# Altium schematic sheet Sub_B_PCB.SchDoc
size C; SheetNumber: 1; SheetTotal: 1
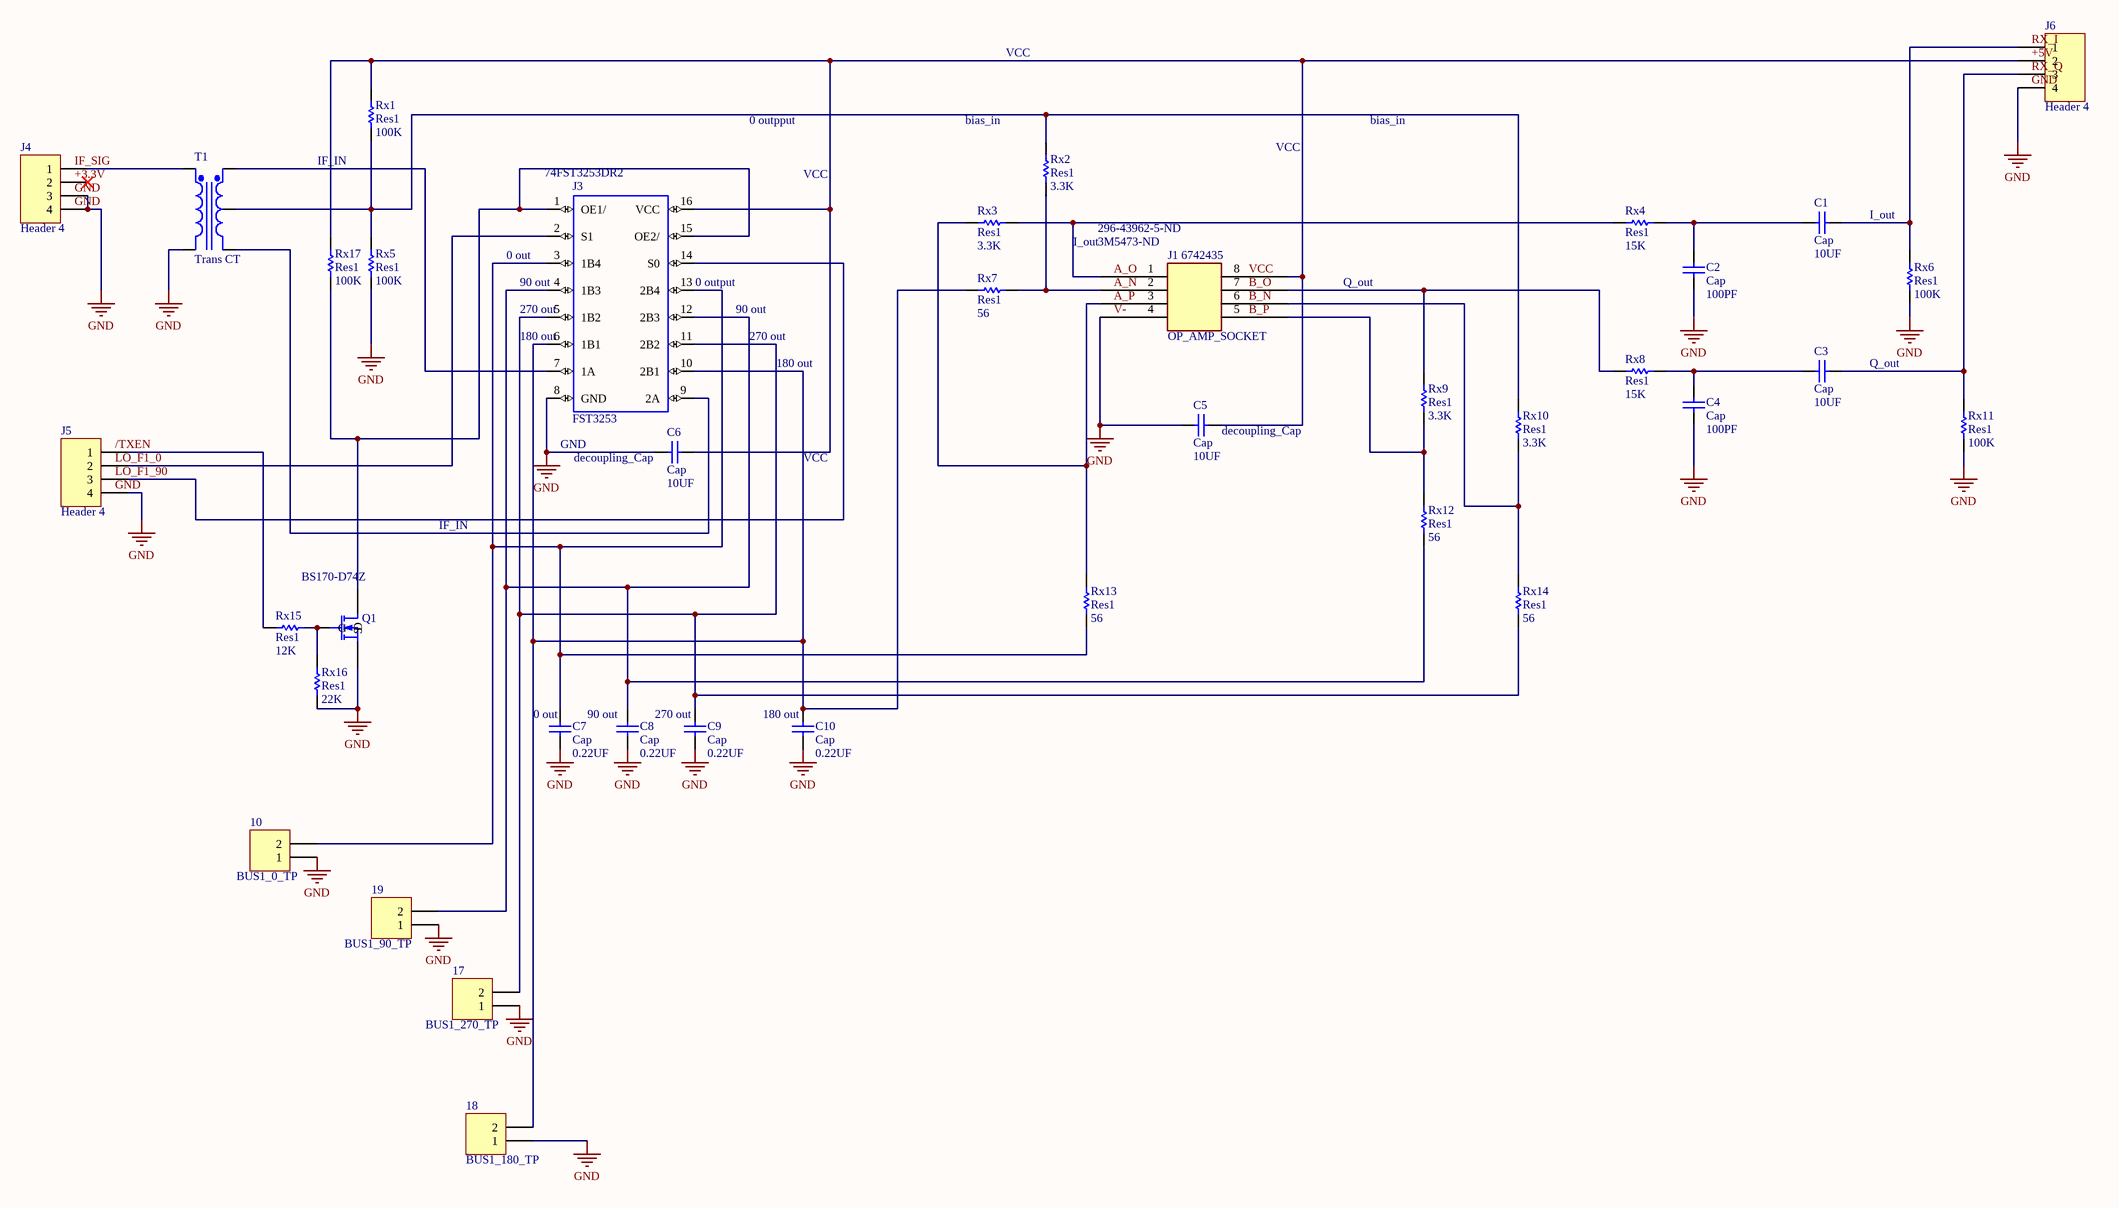
[diagram p0: Sub_B_PCB.SchDoc]

## Parts
10  BUS1_0_TP  [HDR1X2]
17  BUS1_270_TP  [HDR1X2]
18  BUS1_180_TP  [HDR1X2]
19  BUS1_90_TP  [HDR1X2]
C1  Cap  value 10UF  [1206]
C2  Cap  value 100PF  [RADIAL-0.1]
C3  Cap  value 10UF  [1206]
C4  Cap  value 100PF  [RADIAL-0.1]
C5  Cap  value 10UF  [1206]
C6  Cap  value 10UF  [1206]
C7  Cap  value 0.22UF  [RADIAL-0.1]
C8  Cap  value 0.22UF  [RADIAL-0.1]
C9  Cap  value 0.22UF  [RADIAL-0.1]
C10  Cap  value 0.22UF  [RADIAL-0.1]
J1  OP_AMP_SOCKET  Supplier Part Number 2: 6742435  Supplier Part Number 3: 3M5473-ND  Supplier Part Number 4: 296-43962-5-ND  [TE_1-2199298-2]
J3  FST3253  Supplier Part Number 1: 74FST3253DR2  [SOIC127P600X175-16N]
J4  Header 4  [HDR1X4]
J5  Header 4  [HDR1X4]
J6  Header 4  [HDR1X4]
Q1  Supplier Part Number 1: BS170-D74Z  [E3]  (hidden comment: MOSFET-N)
Rx1  Res1  value 100K  [AXIAL-0.1-RES]
Rx2  Res1  value 3.3K  [AXIAL-0.1-RES]
Rx3  Res1  value 3.3K  [AXIAL-0.1-RES]
Rx4  Res1  value 15K  [AXIAL-0.1-RES]
Rx5  Res1  value 100K  [AXIAL-0.1-RES]
Rx6  Res1  value 100K  [AXIAL-0.1-RES]
Rx7  Res1  value 56  [AXIAL-0.1-RES]
Rx8  Res1  value 15K  [AXIAL-0.1-RES]
Rx9  Res1  value 3.3K  [AXIAL-0.1-RES]
Rx10  Res1  value 3.3K  [AXIAL-0.1-RES]
Rx11  Res1  value 100K  [AXIAL-0.1-RES]
Rx12  Res1  value 56  [AXIAL-0.1-RES]
Rx13  Res1  value 56  [AXIAL-0.1-RES]
Rx14  Res1  value 56  [AXIAL-0.1-RES]
Rx15  Res1  value 12K  [AXIAL-0.1-RES]
Rx16  Res1  value 22K  [AXIAL-0.1-RES]
Rx17  Res1  value 100K  [AXIAL-0.1-RES]
T1  Trans CT  [BIFILAR-2402]

## Nets
GND: 10.1 17.1 18.1 19.1 C2.1 C4.1 C5.1 C6.1 C7.1 C8.1 C9.1 C10.1 J1.4(V-) J3.8(GND) J4.3 J4.4 J5.4 J6.4 Q1.3(S) Rx5.1 Rx6.1 Rx11.1 Rx16.1 T1.5(Pri-)
Net10_2: 10.2 C7.2 J3.3(1B4) J3.13(2B4) Rx13.1
Net17_2: 17.2 C9.2 J3.5(1B2) J3.11(2B2) Rx14.1
Net18_2: 18.2 C10.2 J3.6(1B1) J3.10(2B1) Rx7.1
Net19_2: 19.2 C8.2 J3.4(1B3) J3.12(2B3) Rx12.1
NetC1_1: C1.1 C2.2 Rx4.2
NetC1_2: C1.2 J6.1 Rx6.2
NetC3_1: C3.1 C4.2 Rx8.2
NetC3_2: C3.2 J6.3 Rx11.2
NetC5_2: C5.2 C6.2 J1.8(VCC) J3.16(VCC) J6.2 Rx1.2 Rx17.2
NetJ1_1: J1.1(OOUTPUT__A) Rx3.2 Rx4.1
NetJ1_2: J1.2(INVERTING_A) Rx2.1 Rx7.2
NetJ1_3: J1.3(NON-INVERTING_A) Rx3.1 Rx13.2
NetJ1_5: J1.5(NON-INVERTING_B) Rx9.1 Rx12.2
NetJ1_6: J1.6(INVERTING_B) Rx10.1 Rx14.2
NetJ1_7: J1.7(OUTPUT_B) Rx8.1 Rx9.2
NetJ3_1: J3.1(OE1/) J3.15(OE2/) Q1.1(D) Rx17.1
NetJ3_2: J3.2(S1) J5.2
NetJ3_7: J3.7(1A) T1.1(Sec+)
NetJ3_9: J3.9(2A) T1.3(Sec-)
NetJ3_14: J3.14(S0) J5.3
NetJ4_1: J4.1 T1.4(Pri+)
NetJ5_1: J5.1 Rx15.1
NetQ1_2: Q1.2(G) Rx15.2 Rx16.2
NetRx1_1: Rx1.1 Rx2.2 Rx5.2 Rx10.2 T1.2(SecCT)

Not connected (* = marked no-connect by the designer): J4 2*

## Notes on the sheet
- VCC
- 0 outpput
- (near Rx2) bias_in
- bias_in
- (near Rx1) IF_IN
- (near J3) 0 out
- I_out
- (near J3) 90 out
- (near J3) 270 out
- (near J3) 180 out
- (near J3) 0 output
- 90 out
- 270 out
- Q_out
- 180 out
- (near C3) Q_out
- (near J3) GND
- (near C6) decoupling_Cap
- (near C5) decoupling_Cap
- IF_IN
- (near C7) 0 out
- (near C8) 90 out
- (near C9) 270 out
- (near C10) 180 out
- Labels drawn without touching a wire or pin: +3.3V, +5V, /TXEN, A_N, A_O, A_P, B_N, B_O, B_P, GND, IF_SIG, LO_F1_0, LO_F1_90, RX_I, RX_Q, V-, VCC

## Library data of the parts
10 17-19 = Header 2: Header, 2-Pin; LatestRevisionDate: 17-Jul-2002; LatestRevisionNote: Re-released for DXP Platform.; Publisher: Altium Limited
C1 C3 C5 C6 = CAP CER 10UF 16V X5R 1206: Capacitor; Manufacturer Part Number: 885012108017; Designator: C?; Voltage Rating: 16V; Published: 8-Jun-2000; LatestRevisionDate: 17-Jul-2002; LatestRevisionNote: Re-released for DXP Platform.; Publisher: Altium Limited
C2 C4 = CAP CER 100PF 50V C0G/NP0 RADIAL: Capacitor; Manufacturer Part Number: K101K15C0GF53L2; Designator: C?; Voltage Rating: 50V; Published: 8-Jun-2000; LatestRevisionDate: 17-Jul-2002; LatestRevisionNote: Re-released for DXP Platform.; Publisher: Altium Limited
C7-C10 = CAP CER 0.22UF 50V Z5U RADIAL: Capacitor; Manufacturer Part Number: C320C224M5U5TA; Designator: C?; Voltage Rating: 50V; Published: 8-Jun-2000; LatestRevisionDate: 17-Jul-2002; LatestRevisionNote: Re-released for DXP Platform.; Publisher: Altium Limited
J1 = 1-2199298-2: 8 _2 x 4_ Pos DIP, 0.3 _7.62mm_ Row Spacing Socket Tin Through Hole; MF: TE Connectivity; SnapEDA_Link: https://www.snapeda.com/parts/1-2199298-2/TE%20Connectivity%20AMP%20Connectors/view-part/2761758/?ref=snap; Value: *; TE_purchase_URL: https://www.te.com/usa-en/product-1-2199298-2.html?te_bu=Cor&te_type=disp&te_campaign=seda_glo_cor-seda-global-disp-prtnr-fy19-seda-model-bom-cta_sma-317_1&elqCampaignId=32493; Price: None; Availability: Unavailable; MP: 1-2199298-2; Package: None; Supplier 1: RSComponents; Supplier 2: RSComponents; Supplier 3: Digi-Key; Supplier 4: Digi-Key
J3 = FST3253: Multiplekser/demultiplekser 2 x 4:1 16-TSSOP; MF: ON Semiconductor; Purchase-URL: https://pricing.snapeda.com/search/part/FST3253/?ref=eda; Check_prices: https://www.snapeda.com/parts/FST3253/Onsemi/view-part/?ref=eda; Availability: In Stock; Value: *; MP: FST3253; Price: None; Package: TSSOP-16 ON Semiconductor; SnapEDA_Link: https://www.snapeda.com/parts/FST3253/Onsemi/view-part/?ref=snap; Supplier 1: Avnet
J4-J6 = Header 4: Header, 4-Pin; LatestRevisionDate: 17-Jul-2002; LatestRevisionNote: Re-released for DXP Platform.; Publisher: Altium Limited
Q1 = MOSFET-N: N-Channel MOSFET; Published: 8-Jun-2000; LatestRevisionDate: 17-Jul-2002; LatestRevisionNote: Re-released for DXP Platform.; PackageVersion: 1995/1996; PackageReference: E3; Publisher: Altium Limited; PackageDescription: TO, Flat Index; 3 In-Line, Axial Leads; Body Dia. 4.6mm; Lead Dia. 0.5 mm (max); Supplier 1: Avnet
Rx1 Rx5 Rx6 Rx11 Rx17 = RES 100K OHM 5% 1/4W AXIAL: Resistor; Manufacturer Part Number: CFR-25JB-52-100K; Designator: R?; Power Rating: 1/4W; Tolerance: 0.05; Published: 8-Jun-2000; LatestRevisionDate: 17-Jul-2002; LatestRevisionNote: Re-released for DXP Platform.; Publisher: Altium Limited
Rx2 Rx3 Rx9 Rx10 = RES 3.3K OHM 5% 1/4W AXIAL: Resistor; Manufacturer Part Number: CFR-25JB-52-3K3; Designator: R?; Power Rating: 1/4W; Tolerance: 0.05; Published: 8-Jun-2000; LatestRevisionDate: 17-Jul-2002; LatestRevisionNote: Re-released for DXP Platform.; Publisher: Altium Limited
Rx4 Rx8 = RES 15K OHM 5% 1/4W AXIAL: Resistor; Manufacturer Part Number: CFR-25JB-52-15K; Designator: R?; Power Rating: 1/4W; Tolerance: 0.05; Published: 8-Jun-2000; LatestRevisionDate: 17-Jul-2002; LatestRevisionNote: Re-released for DXP Platform.; Publisher: Altium Limited
Rx7 Rx12-Rx14 = RES 56 OHM 5% 1/4W AXIAL: Resistor; Manufacturer Part Number: CFR-25JB-52-56R; Designator: R?; Power Rating: 1/4W; Tolerance: 0.05; Published: 8-Jun-2000; LatestRevisionDate: 17-Jul-2002; LatestRevisionNote: Re-released for DXP Platform.; Publisher: Altium Limited
Rx15 = RES 12K OHM 5% 1/4W AXIAL: Resistor; Manufacturer Part Number: CFR-25JB-52-12K; Designator: R?; Power Rating: 1/4W; Tolerance: 0.05; Published: 8-Jun-2000; LatestRevisionDate: 17-Jul-2002; LatestRevisionNote: Re-released for DXP Platform.; Publisher: Altium Limited
Rx16 = RES 22K OHM 5% 1/4W AXIAL: Resistor; Manufacturer Part Number: CFR-25JB-52-22K; Designator: R?; Power Rating: 1/4W; Tolerance: 0.05; Published: 8-Jun-2000; LatestRevisionDate: 17-Jul-2002; LatestRevisionNote: Re-released for DXP Platform.; Publisher: Altium Limited
T1 = Centre-tapped transformer wound on a binocular core: Center-Tapped Transformer (Coupled Inductor Model); Designator: T?; Published: 8-Jun-2000; LatestRevisionDate: 17-Jul-2002; LatestRevisionNote: Re-released for DXP Platform.; Publisher: Altium Limited